# EAGLE design board (EAGLE 7.3.0)
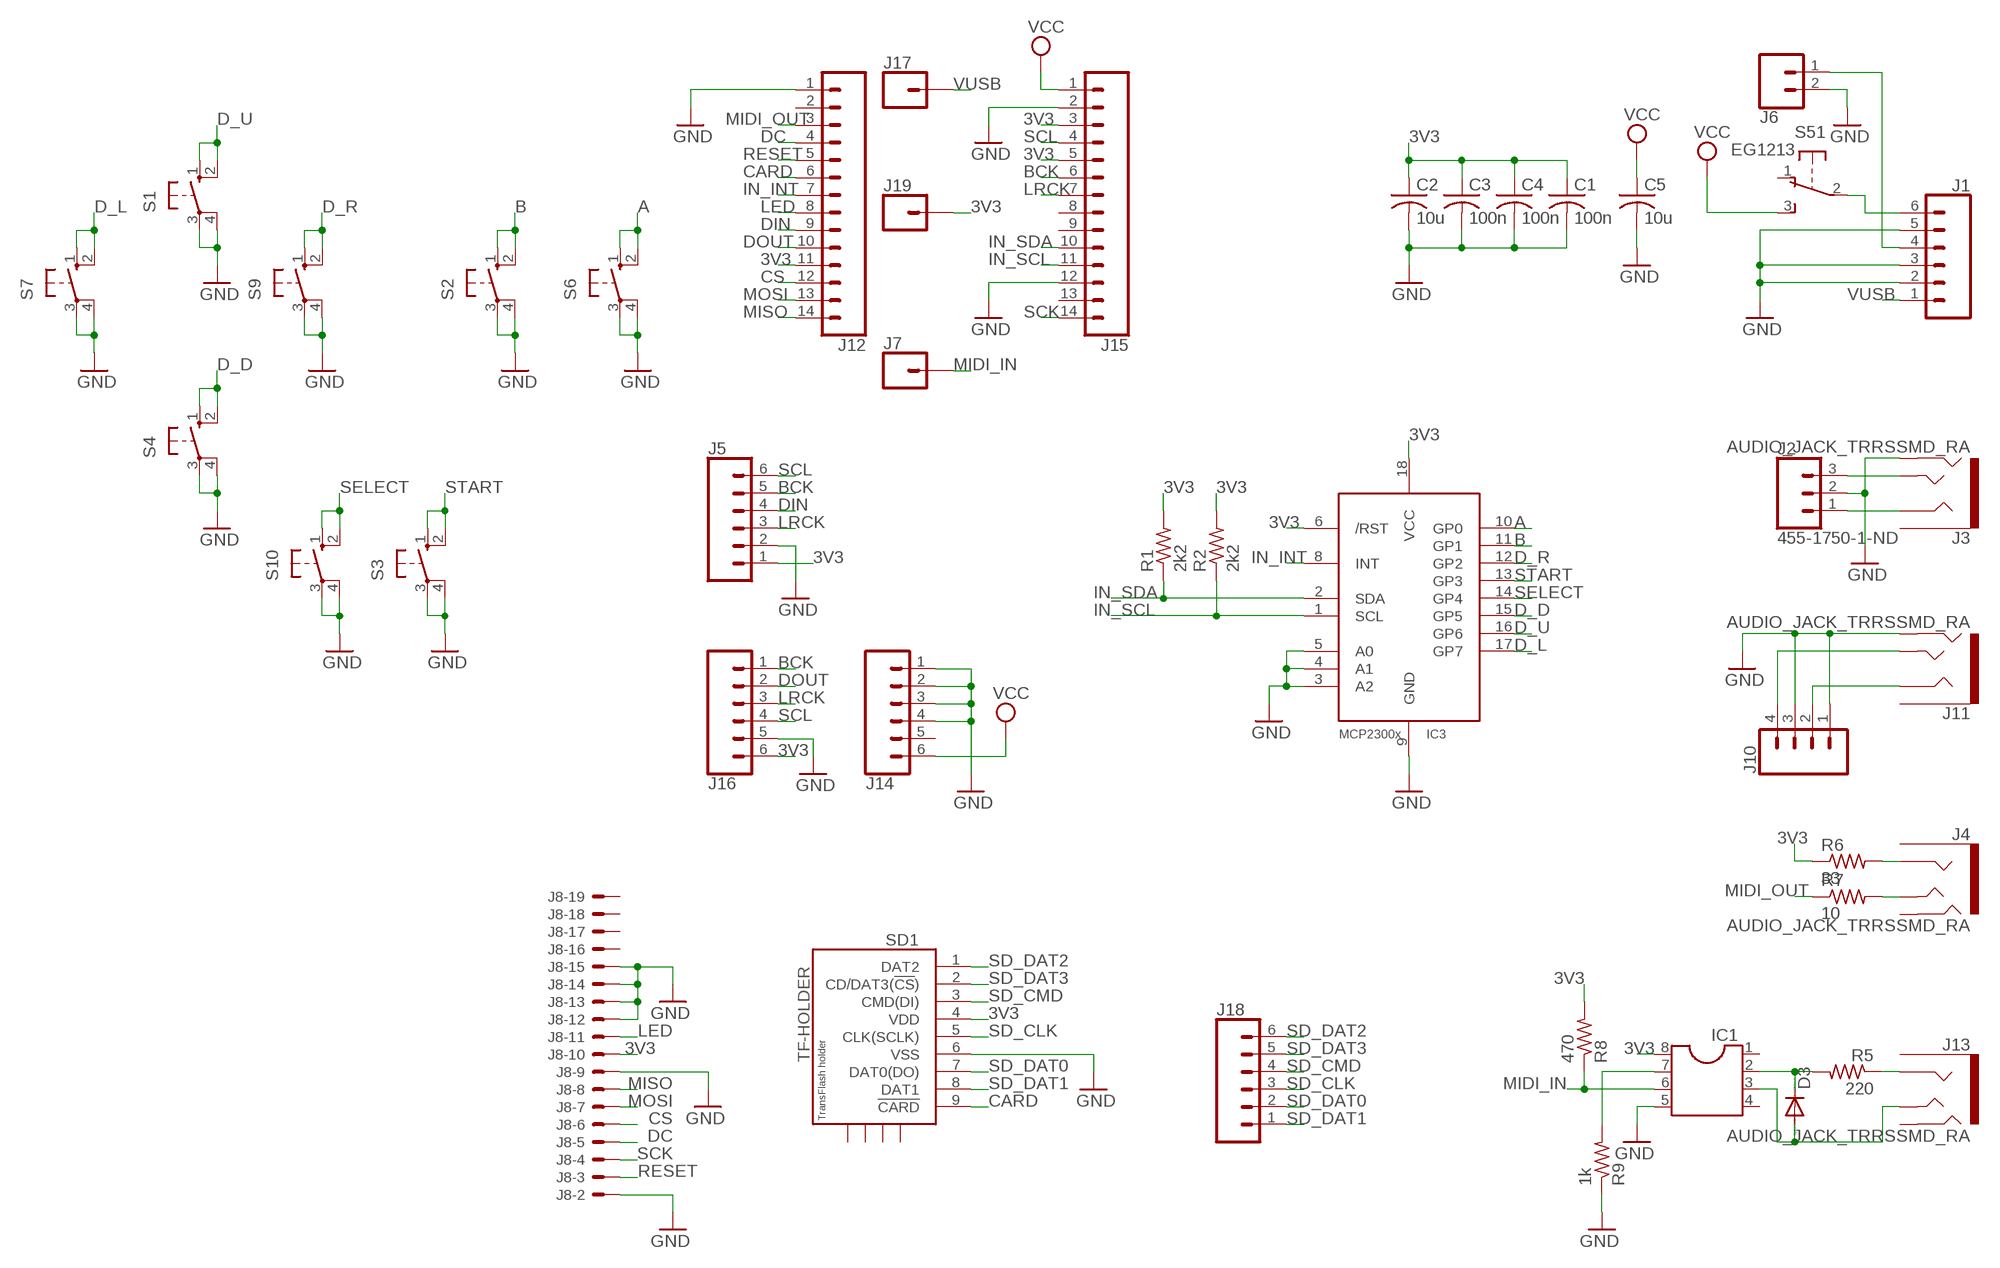
[diagram p0: schematic, sheet 1]

## Parts
C1  100n  C-USC0805  [C0805]
C2  10u  C-USC0805  [C0805]
C3  100n  C-USC0805  [C0805]
C4  100n  C-USC0805  [C0805]
C5  10u  C-USC0805  [C0805]
D3  DIODE-MINIMELF  [MINIMELF]
IC1  DIL8  [DIL08]
IC3  MCP23008/SO  [SO18W]
J1  CONN_06SILK_FEMALE_PTH  [1X06]
J2  455-1750-1-ND  CONN_03  [1X03]
J3  AUDIO_JACK_TRRSSMD_RA  [AUDIO_JACK_3.5MM_TRRS_SMD_RA]
J4  AUDIO_JACK_TRRSSMD_RA  [AUDIO_JACK_3.5MM_TRRS_SMD_RA]
J5  CONN_06SILK_FEMALE_PTH  [1X06]
J6  CONN_02  [1X02]
J7  CONN_01  [1X01]
J8  XF2E-2015-1  [XF2E-2015-1]
J10  CONN_04  [1X04]
J11  AUDIO_JACK_TRRSSMD_RA  [AUDIO_JACK_3.5MM_TRRS_SMD_RA]
J12  CONN_14  [1X14]
J13  AUDIO_JACK_TRRSSMD_RA  [AUDIO_JACK_3.5MM_TRRS_SMD_RA]
J14  CONN_06SILK_FEMALE_PTH  [1X06]
J15  CONN_14  [1X14]
J16  CONN_06SILK_FEMALE_PTH  [1X06]
J17  CONN_01  [1X01]
J18  CONN_06SILK_FEMALE_PTH  [1X06]
J19  CONN_01  [1X01]
R1  2k2  R-US_R0805  [R0805]
R2  2k2  R-US_R0805  [R0805]
R5  220  R-US_R0805  [R0805]
R6  33  R-US_R0805  [R0805]
R7  10  R-US_R0805  [R0805]
R8  470  R-US_R0805  [R0805]
R9  1k  R-US_R0805  [R0805]
S1  10-XX  [B3F-10XX]
S2  10-XX  [B3F-10XX]
S3  10-XX  [B3F-10XX]
S4  10-XX  [B3F-10XX]
S5  EG1213  [EG1213]
S6  10-XX  [B3F-10XX]
S7  10-XX  [B3F-10XX]
S9  10-XX  [B3F-10XX]
S10  10-XX  [B3F-10XX]
SD1  TF-HOLDER  [TF-PULL]

## Nets
3V3: C1.1 C2.1 C3.1 C4.1 IC1.8 IC3.6(/RST) IC3.18(VCC) J5.1 J8.10 J12.11 J15.3 J15.5 J16.6 J19.1 R1.2 R2.2 R6.1 R8.2 SD1.4(VDD)
A: IC3.10(GP0) S6.1(S) S6.2(S1)
B: IC3.11(GP1) S2.1(S) S2.2(S1)
BCK: J5.5 J15.6 J16.1
CARD: J12.6 SD1.9(!CARD)
CS: J8.6 J12.12
D_D: IC3.15(GP5) S4.1(S) S4.2(S1)
D_L: IC3.17(GP7) S7.1(S) S7.2(S1)
D_R: IC3.12(GP2) S9.1(S) S9.2(S1)
D_U: IC3.16(GP6) S1.1(S) S1.2(S1)
DC: J8.5 J12.4
DIN: J5.4 J12.9
DOUT: J12.10 J16.2
GND: C1.2 C2.2 C3.2 C4.2 C5.2 IC1.5 IC3.3(A2) IC3.4(A1) IC3.5(A0) IC3.9(GND) J1.2 J1.3 J1.5 J2.2 J3.RING2 J5.2 J6.2 J8.2 J8.9 J8.12 J8.13 J8.14 J8.15 J10.1 J10.3 J11.RING2 J12.1 J14.1 J14.2 J14.3 J14.4 J15.2 J15.12 J16.5 R9.1 S1.3(P) S1.4(P1) S2.3(P) S2.4(P1) S3.3(P) S3.4(P1) S4.3(P) S4.4(P1) S6.3(P) S6.4(P1) S7.3(P) S7.4(P1) S9.3(P) S9.4(P1) S10.3(P) S10.4(P1) SD1.6(VSS)
IN_INT: IC3.8(INT) J12.7
IN_SCL: IC3.1(SCL) J15.11 R2.1
IN_SDA: IC3.2(SDA) J15.10 R1.1
LED: J8.11 J12.8
LRCK: J5.3 J15.7 J16.3
MIDI_IN: IC1.6 J7.1 R8.1
MIDI_OUT: J12.3 R7.1
MISO: J8.8 J12.14
MOSI: J8.7 J12.13
N$2: J2.3 J3.TIP
N$3: J2.1 J3.RING1
N$4: J10.4 J11.TIP
N$5: J10.2 J11.RING1
N$6: J1.4 J6.1
N$14: J4.RING1 R6.2
N$16: J4.TIP R7.2
N$17: J13.RING1 R5.1
N$18: D3.C IC1.2 R5.2
N$19: D3.A IC1.3 J13.TIP
N$22: IC1.7 R9.2
N$24: J1.6 S5.2(1:P)
RESET: J8.3 J12.5
SCK: J8.4 J15.14
SCL: J5.6 J15.4 J16.4
SD_CLK: J18.3 SD1.5(CLK(SCLK))
SD_CMD: J18.4 SD1.3(CMD(DI))
SD_DAT0: J18.2 SD1.7(DAT0(DO))
SD_DAT1: J18.1 SD1.8(DAT1)
SD_DAT2: J18.6 SD1.1(DAT2)
SD_DAT3: J18.5 SD1.2(CD/DAT3(!CS!))
SELECT: IC3.14(GP4) S10.1(S) S10.2(S1)
START: IC3.13(GP3) S3.1(S) S3.2(S1)
VCC: C5.1 J14.6 J15.1 S5.3(1:S)
VUSB: J1.1 J17.1
Unconnected: IC1.1 IC1.4 J3.EARTH J4.EARTH J4.RING2 J8.16 J8.17 J8.18 J8.19 J11.EARTH J12.2 J13.EARTH J13.RING2 J14.5 J15.8 J15.9 J15.13 S5.1(1:O) S5.MT1(MT) S5.MT2(MT) SD1.S1 SD1.S2 SD1.S3 SD1.S4

## Library data of the parts
C1-C5 = rcl:C-US: CAPACITOR, American symbol
D3 = diode:DIODE-: DIODE
IC1 = ic-package:DIL8: Dual In Line / Socket
IC3 = adafruit:MCP23008: MCP23008 Inexpensive i2c i/o expander - 8 general purpose i/o pins with optional pullups
J1 J5 J14 J16 J18 = lbr_SparkFun-Eagle-Libraries_SparkFun-Connectors:CONN_06: Multi connection point. Often used as Generic Header-pin footprint for 0.1 inch spaced/style header connections On any of the 0.1 inch spaced packages, you can populate with these: Break Away Headers - Straight <https://www.sparkfun.com/products/116> (PRT-00116) Break Away Male Headers - Right Angle <https://www.sparkfun.com/products/553> (PRT-00553) Female Headers <https://www.sparkfun.com/products/115> (PRT-00115) Break Away Headers - Machine Pin <https://www.sparkfun.com/products/117> (PRT-00117) Break Away Female Headers - Swiss Machine Pin <https://www.sparkfun.com/products/743> (PRT-00743) Arduino Stackable Header - 6 Pin <https://www.sparkfun.com/products/9280> (PRT-09280) For SCREWTERMINALS and SPRING TERMINALS visit here: Screw Terimnals on SparkFun.com <https://www.sparkfun.com/search/results?term=Screw+Terminals> (5mm/3.5mm/2.54mm spacing) This device is also useful as a general connection point to wire up your design to another part of your project. Our various solder wires solder well into these plated through hole pads. Hook-Up Wire - Assortment (Stranded, 22 AWG) <https://www.sparkfun.com/products/11375> (PRT-11375) Hook-Up Wire - Assortment (Solid Core, 22 AWG) <https://www.sparkfun.com/products/11367> (PRT-11367) View the entire wire category on our website here <https://www.sparkfun.com/categories/141>; PROD_ID: CONN-08437
J2 = lbr_SparkFun-Eagle-Libraries_SparkFun-Connectors:CONN_03: Multi connection point. Often used as Generic Header-pin footprint for 0.1 inch spaced/style header connections On any of the 0.1 inch spaced packages, you can populate with these: Break Away Headers - Straight <https://www.sparkfun.com/products/116> (PRT-00116) Break Away Male Headers - Right Angle <https://www.sparkfun.com/products/553> (PRT-00553) Female Headers <https://www.sparkfun.com/products/115> (PRT-00115) Break Away Headers - Machine Pin <https://www.sparkfun.com/products/117> (PRT-00117) Break Away Female Headers - Swiss Machine Pin <https://www.sparkfun.com/products/743> (PRT-00743) Stackable Header - 3 Pin (Female, 0.1") <https://www.sparkfun.com/products/13875> (PRT-13875) For SCREWTERMINALS and SPRING TERMINALS visit here: Screw Terimnals on SparkFun.com <https://www.sparkfun.com/search/results?term=Screw+Terminals> (5mm/3.5mm/2.54mm spacing) This device is also useful as a general connection point to wire up your design to another part of your project. Our various solder wires solder well into these plated through hole pads. Hook-Up Wire - Assortment (Stranded, 22 AWG) <https://www.sparkfun.com/products/11375> (PRT-11375) Hook-Up Wire - Assortment (Solid Core, 22 AWG) <https://www.sparkfun.com/products/11367> (PRT-11367) View the entire wire category on our website here <https://www.sparkfun.com/categories/141> Special notes: Molex polarized connector foot print use with SKU : PRT-08232 with associated crimp pins and housings.; PROD_ID: XXX-00000
J3 J4 J11 J13 = lbr_SparkFun-Eagle-Libraries_SparkFun-Connectors:AUDIO_JACK_TRRS: Audio Jack - 3.5mm TRRS (SMD) This is a 3.5mm TRRS SMD audio jack. TRRS connectors are the audio-style connectors that you see on some phones, MP3 players and development boards. TRRS stands for “tip, ring, ring, sleeve,” which reflects that this has three conductors and a ground. SparkFun Products: Audio Jack <https://www.sparkfun.com/products/12639> mbed Starter Kit <https://www.sparkfun.com/products/12968> SparkFun TRRS 3.5mm Jack Breakout <https://www.sparkfun.com/products/11570>; PROD_ID: CONN-10676; SF_ID: PRT-12639
J6 = lbr_SparkFun-Eagle-Libraries_SparkFun-Connectors:CONN_02: Multi connection point. Often used as Generic Header-pin footprint for 0.1 inch spaced/style header connections On any of the 0.1 inch spaced packages, you can populate with these: Break Away Headers - Straight <https://www.sparkfun.com/products/116> (PRT-00116) Break Away Male Headers - Right Angle <https://www.sparkfun.com/products/553> (PRT-00553) Female Headers <https://www.sparkfun.com/products/115> (PRT-00115) Break Away Headers - Machine Pin <https://www.sparkfun.com/products/117> (PRT-00117) Break Away Female Headers - Swiss Machine Pin <https://www.sparkfun.com/products/743> (PRT-00743) For SCREWTERMINALS and SPRING TERMINALS visit here: Screw Terimnals on SparkFun.com <https://www.sparkfun.com/search/results?term=Screw+Terminals> (5mm/3.5mm/2.54mm spacing) This device is also useful as a general connection point to wire up your design to another part of your project. Our various solder wires solder well into these plated through hole pads. Hook-Up Wire - Assortment (Stranded, 22 AWG) <https://www.sparkfun.com/products/11375> (PRT-11375) Hook-Up Wire - Assortment (Solid Core, 22 AWG) <https://www.sparkfun.com/products/11367> (PRT-11367) View the entire wire category on our website here <https://www.sparkfun.com/categories/141> Special notes: Molex polarized connector foot print use with: PRT-08233 with associated crimp pins and housings. 2.54_SCREWTERM for use with PRT-10571. 3.5mm Screw Terminal footprints for PRT-08084 5mm Screw Terminal footprints for use with PRT-08432
J7 J17 J19 = lbr_SparkFun-Eagle-Libraries_SparkFun-Connectors:CONN_01: Single connection point. Often used as Generic Header-pin footprint for 0.1 inch spaced/style header connections On any of the 0.1 inch spaced packages, you can populate with these: Break Away Headers - Straight <https://www.sparkfun.com/products/116> (PRT-00116) Break Away Male Headers - Right Angle <https://www.sparkfun.com/products/553> (PRT-00553) Female Headers <https://www.sparkfun.com/products/115> (PRT-00115) Break Away Headers - Machine Pin <https://www.sparkfun.com/products/117> (PRT-00117) Break Away Female Headers - Swiss Machine Pin <https://www.sparkfun.com/products/743> (PRT-00743) This device is also useful as a general connection point to wire up your design to another part of your project. Our various solder wires solder well into these plated through hole pads. Hook-Up Wire - Assortment (Stranded, 22 AWG) <https://www.sparkfun.com/products/11375> (PRT-11375) Hook-Up Wire - Assortment (Solid Core, 22 AWG) <https://www.sparkfun.com/products/11367> (PRT-11367) View the entire wire category on our website here <https://www.sparkfun.com/categories/141> Special notes: SMTSO-256-ET is a "flush mount" nut for a 4-40 screw. We mostly use this on specialty testbeds; it is a nice way to connect hardware to your PCB at an adjustable hieght. Also note, the SNAP packages are for using a snappable style connector. We sell a baggie of snaps and they are also used on two LilyPad designs: Snap Assortment - 30 pack (male and female) <https://www.sparkfun.com/products/11347> (DEV-11347) LilyPad Arduino SimpleSnap <https://www.sparkfun.com/products/10941> (DEV-10941) LilyPad SimpleSnap Protoboard <https://www.sparkfun.com/products/10940> (DEV-10940)
J8 = con-omron-kopia:XF2*-20?: OMRON FPC Connector Source : http://www.omron.com/ecb/products/pdf/fpc.pdf; MPN: XF2E-2015-1; OC_FARNELL: unknown; OC_NEWARK: 37M9453
J10 = lbr_SparkFun-Eagle-Libraries_SparkFun-Connectors:CONN_04: Multi connection point. Often used as Generic Header-pin footprint for 0.1 inch spaced/style header connections On any of the 0.1 inch spaced packages, you can populate with these: Break Away Headers - Straight <https://www.sparkfun.com/products/116> (PRT-00116) Break Away Male Headers - Right Angle <https://www.sparkfun.com/products/553> (PRT-00553) Female Headers <https://www.sparkfun.com/products/115> (PRT-00115) Break Away Headers - Machine Pin <https://www.sparkfun.com/products/117> (PRT-00117) Break Away Female Headers - Swiss Machine Pin <https://www.sparkfun.com/products/743> (PRT-00743) For SCREWTERMINALS and SPRING TERMINALS visit here: Screw Terimnals on SparkFun.com <https://www.sparkfun.com/search/results?term=Screw+Terminals> (5mm/3.5mm/2.54mm spacing) This device is also useful as a general connection point to wire up your design to another part of your project. Our various solder wires solder well into these plated through hole pads. Hook-Up Wire - Assortment (Stranded, 22 AWG) <https://www.sparkfun.com/products/11375> (PRT-11375) Hook-Up Wire - Assortment (Solid Core, 22 AWG) <https://www.sparkfun.com/products/11367> (PRT-11367) View the entire wire category on our website here <https://www.sparkfun.com/categories/141> Special notes: Molex polarized connector foot print use with SKU : PRT-08231 with associated crimp pins and housings. 1MM SMD Version SKU: PRT-10208; PROD_ID: CONN-09696
J12 J15 = lbr_SparkFun-Eagle-Libraries_SparkFun-Connectors:CONN_14: Multi connection point. Often used as Generic Header-pin footprint for 0.1 inch spaced/style header connections On any of the 0.1 inch spaced packages, you can populate with these: Break Away Headers - Straight <https://www.sparkfun.com/products/116> (PRT-00116) Break Away Male Headers - Right Angle <https://www.sparkfun.com/products/553> (PRT-00553) Female Headers <https://www.sparkfun.com/products/115> (PRT-00115) Break Away Headers - Machine Pin <https://www.sparkfun.com/products/117> (PRT-00117) Break Away Female Headers - Swiss Machine Pin <https://www.sparkfun.com/products/743> (PRT-00743) For SCREWTERMINALS and SPRING TERMINALS visit here: Screw Terimnals on SparkFun.com <https://www.sparkfun.com/search/results?term=Screw+Terminals> (5mm/3.5mm/2.54mm spacing) This device is also useful as a general connection point to wire up your design to another part of your project. Our various solder wires solder well into these plated through hole pads. Hook-Up Wire - Assortment (Stranded, 22 AWG) <https://www.sparkfun.com/products/11375> (PRT-11375) Hook-Up Wire - Assortment (Solid Core, 22 AWG) <https://www.sparkfun.com/products/11367> (PRT-11367) View the entire wire category on our website here <https://www.sparkfun.com/categories/141> Special notes: Molex polarized connector foot print use with SKU : PRT-08231 with associated crimp pins and housings. 1MM SMD Version SKU: PRT-10208 NOTES ON THE VARIANTS LOCK and LOCK_LONGPADS... This footprint was designed to help hold the alignment of a through-hole component (i.e. 6-pin header) while soldering it into place. You may notice that each hole has been shifted either up or down by 0.005 of an inch from it's more standard position (which is a perfectly straight line). This slight alteration caused the pins (the squares in the middle) to touch the edges of the holes. Because they are alternating, it causes a "brace" to hold the component in place. 0.005 has proven to be the perfect amount of "off-center" position when using our standard breakaway headers. Although looks a little odd when you look at the bare footprint, once you have a header in there, the alteration is very hard to notice. Also,if you push a header all the way into place, it is covered up entirely on the bottom side.
R1 R2 R5-R9 = rcl:R-US_: RESISTOR, American symbol
S1-S4 S6 S7 S9 S10 = switch-omron:10-XX: OMRON SWITCH; MPN: B3F-1000; OC_FARNELL: 176432; OC_NEWARK: 36M3542
S5 = adafruit:EG1213: E-Switch right-angle slide SPDT Part #EG1213 http://www.ladyada.net/library/eagle
SD1 = sd-mmc:TF-HOLDER: TF / Micro SD socket is PUSH-PUSH type, the card can be pushed into and auto locked and pushed out by simply press the card. Surface Mounting type.

## Board
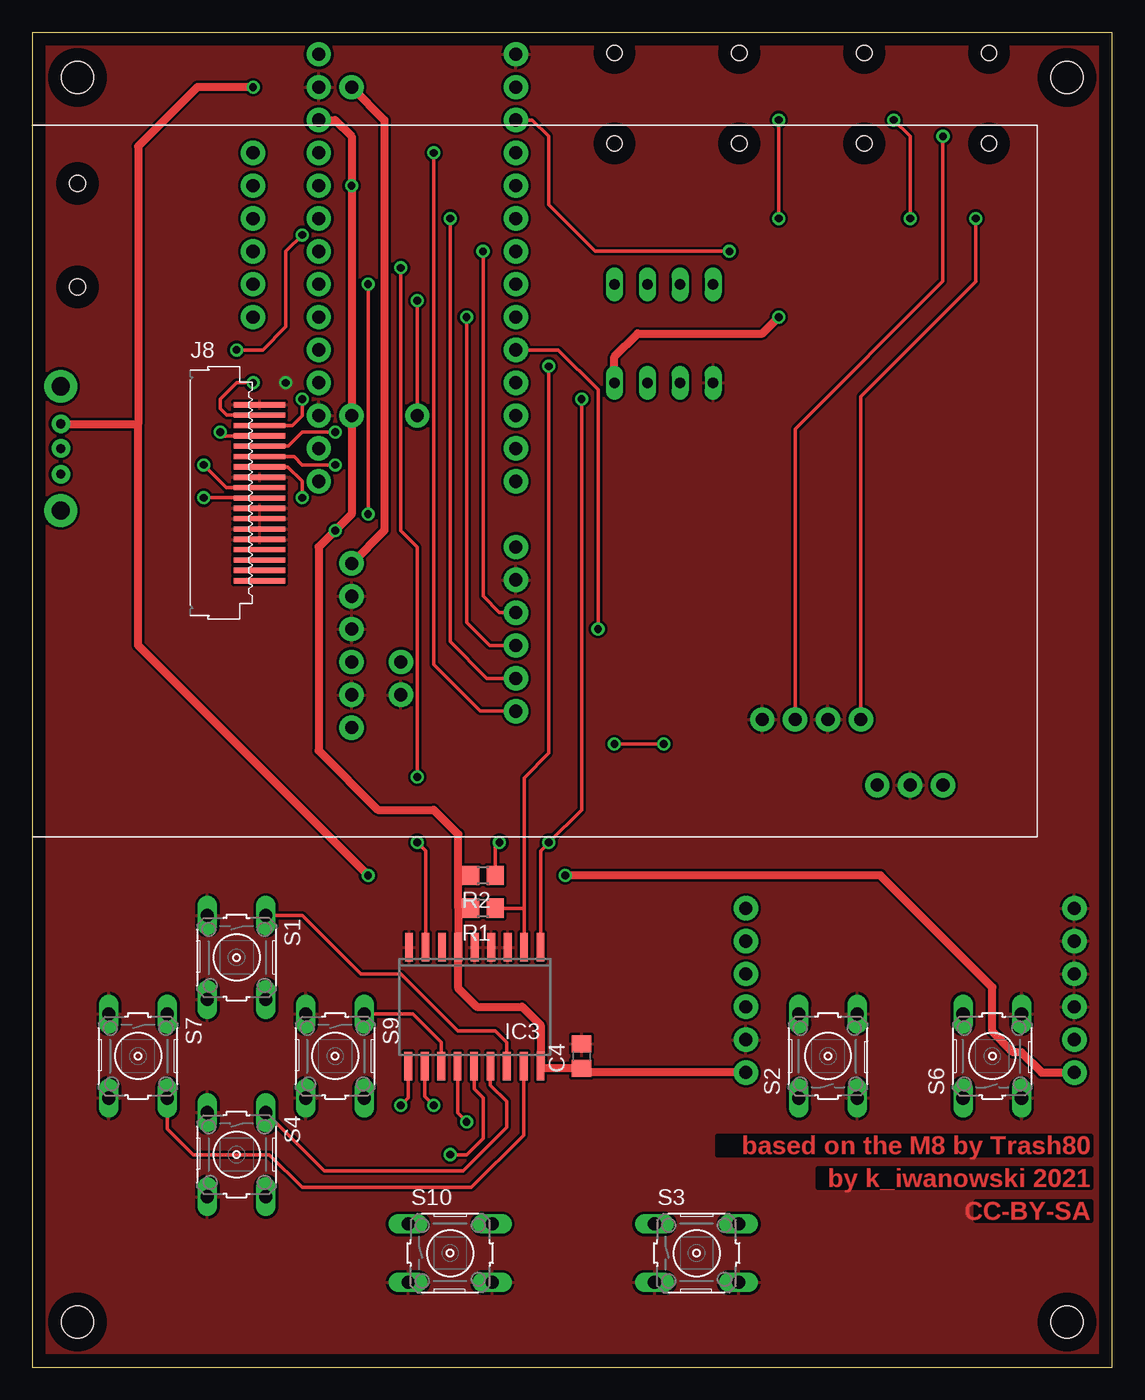
[diagram p1: board, top side]
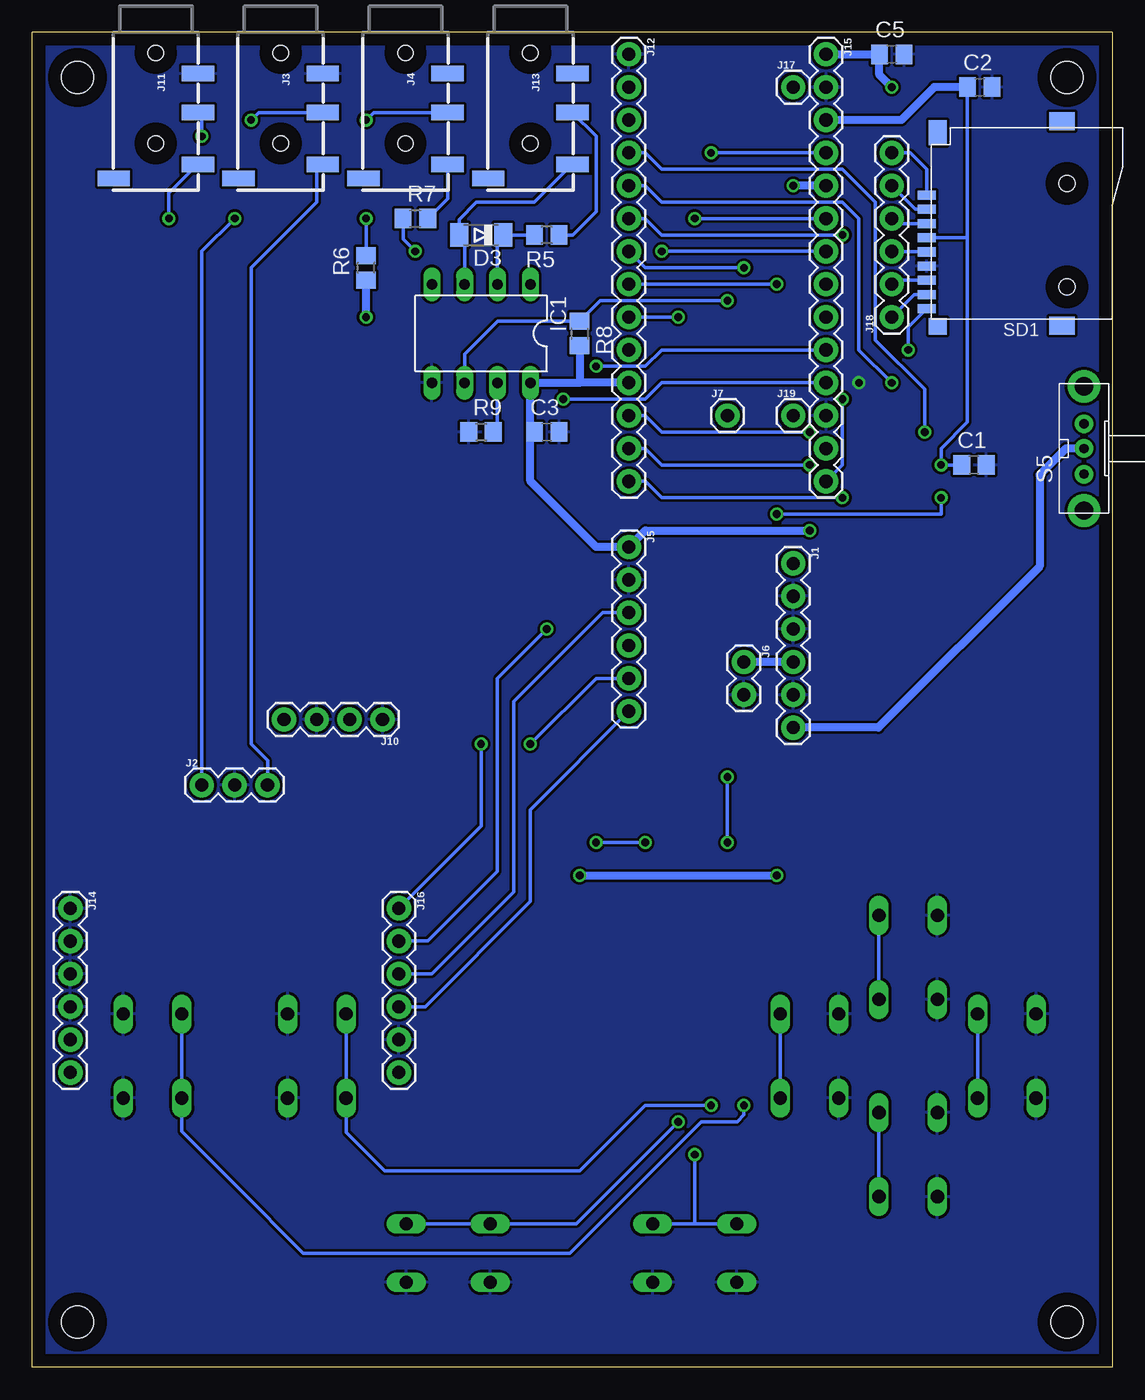
[diagram p2: board, bottom side, seen from below]

Size 83.5 x 103.23 mm. Coordinates in mm from the lower left corner, seen from the top.
Outline: 0,103.23 0,0 83.5,0 83.5,103.23 0,103.23
Copper layers (1*16): Top 0.035mm / dielectric 1.5mm / Bottom 0.035mm
Design rules "default *": minimum track width 8mil, minimum drill 24mil, track to track 8mil, track to pad 8mil, pad to pad 8mil, via to via 8mil, smd to smd 8mil, copper to edge 40mil, drill to drill 8mil, minimum pad ring 10mil, minimum via ring 8mil, stop-mask expansion 4mil, vias tented up to drill 0mil, thermal gap 8mil
Holes 2.5 mm at 3.5,99.73 80,99.73 3.5,3.5 80,3.5

### Footprints (pad centres in the part's own frame; a part is rotated, then mirrored left to right if it is on the bottom)
C0805 = smd 1.3 x 1.5: 1 -0.95,0; 2 0.95,0
MINIMELF = smd 1.4 x 1.8: A 1.7,0; C -1.7,0
DIL08 = drill 0.813 long: 1 -3.81,-3.81; 2 -1.27,-3.81; 3 1.27,-3.81; 4 3.81,-3.81; 5 3.81,3.81; 6 1.27,3.81; 7 -1.27,3.81; 8 -3.81,3.81
SO18W = smd 0.6 x 2.2: 1 -4.445,-4.6; 2 -3.175,-4.6; 3 -1.905,-4.6; 4 -0.635,-4.6; 5 0.635,-4.6; 6 1.905,-4.6; 7 3.175,-4.6; 8 4.445,-4.6; 9 5.715,-4.6; 10 5.775,4.6; 11 4.505,4.6; 12 3.235,4.6; 13 1.965,4.6; 14 0.695,4.6; 15 -0.575,4.6; 16 -1.845,4.6; 17 -3.145,4.6; 18 -4.445,4.6
1X06 = drill 1.016 pad 1.88: 1 0,0; 2 2.54,0; 3 5.08,0; 4 7.62,0; 5 10.16,0; 6 12.7,0
1X03 = drill 1.016 pad 1.88: 1 0,0; 2 2.54,0; 3 5.08,0
AUDIO_JACK_3.5MM_TRRS_SMD_RA = smd 1.2 x 2.5: EARTH 11.3,-3.25; RING1 6.2,3.25; RING2 3.2,3.25; TIP 10.2,3.25 | hole 1.2: 1.6,0; 8.6,0
1X02 = drill 1.016 pad 1.88: 1 0,0; 2 2.54,0
1X01 = drill 1.016 pad 1.88: 1 0,0
XF2E-2015-1 = smd 4 x 0.4: 2 2.54,6.8; 3 2.54,6; 4 2.54,5.2; 5 2.54,4.4; 6 2.54,3.6; 7 2.54,2.8; 8 2.54,2; 9 2.54,1.2; 10 2.54,0.4; 11 2.54,-0.4; 12 2.54,-1.2; 13 2.54,-2; 14 2.54,-2.8; 15 2.54,-3.6; 16 2.54,-4.4; 17 2.54,-5.2; 18 2.54,-6; 19 2.54,-6.8
1X04 = drill 1.016 pad 1.88: 1 0,0; 2 2.54,0; 3 5.08,0; 4 7.62,0
1X14 = drill 1.016 pad 1.88: 1 0,0; 2 2.54,0; 3 5.08,0; 4 7.62,0; 5 10.16,0; 6 12.7,0; 7 15.24,0; 8 17.78,0; 9 20.32,0; 10 22.86,0; 11 25.4,0; 12 27.94,0; 13 30.48,0; 14 33.02,0
R0805 = smd 1.3 x 1.5: 1 -0.95,0; 2 0.95,0
B3F-10XX = drill 1.016 long: 1 -3.251,2.261; 2 3.251,2.261; 3 -3.251,-2.261; 4 3.251,-2.261
EG1213 = drill 0.7 pad 1.422: 1 -2,0; 2 0,0; 3 1.9,0 | drill 1.4 pad 2.54: MT1 -4.8,0; MT2 4.8,0
TF-PULL = smd 0.7 x 1.4: 1 -2.2,-7.62; 2 -1.1,-7.62; 3 0,-7.62; 4 1.1,-7.62; 5 2.2,-7.62; 6 3.3,-7.62; 7 4.4,-7.62; 8 5.5,-7.62; 9 6.6,-7.62 | smd 1.4 x 2: S1 -7.9,2.85; S2 7.9,2.85 | smd 1.28 x 1.4: S3 7.96,-6.75 | smd 1.95 x 1.4: S4 -7.025,-6.75 | hole 1.25: -3.1,3.25; 4.9,3.25

### Placement (x,y rotation side)
C1  10.71,69.78 0 bottom
C2  10.26,98.99 0 bottom
C3  43.73,72.32 0 bottom
C4  42.46,24.06 90 top
C5  17.06,101.53 0 bottom
D3  48.81,87.56 180 bottom
IC1  48.81,79.94 180 bottom
IC3  34.84,27.87 180 top
J1  24.68,62.16 270 bottom
J2  70.4,45.02 0 bottom
J3  64.3,103.23 270 bottom
J4  54.65,103.23 270 bottom
J5  37.38,63.43 270 bottom
J6  28.49,54.54 270 bottom
J7  29.76,73.59 0 bottom
J8  15.03,67.62 0 top
J10  56.43,50.09 180 bottom
J11  73.96,103.23 270 bottom
J12  37.38,101.53 270 bottom
J13  45,103.23 270 bottom
J14  80.56,35.49 270 bottom
J15  22.14,101.53 270 bottom
J16  55.16,35.49 270 bottom
J17  24.68,98.99 0 bottom
J18  17.06,81.21 90 bottom
J19  24.68,73.59 0 bottom
R1  34.84,35.49 180 top
R2  34.84,38.03 180 top
R5  43.73,87.56 180 bottom
R6  57.7,85.02 90 bottom
R7  53.89,88.83 0 bottom
R8  41.19,79.94 270 bottom
R9  48.81,72.32 0 bottom
S1  15.79,31.68 270 top
S2  61.51,24.06 90 top
S3  51.35,8.82 0 top
S4  15.79,16.44 270 top
S5  2.2,71.05 90 bottom
S6  74.21,24.06 90 top
S7  8.17,24.06 270 top
S9  23.41,24.06 270 top
S10  32.3,8.82 0 top
SD1  6.75,88.45 270 bottom

### Tracks (layer width: path | path; a pad name or v marks a point on that pad's centre or on a via)
3V3  (via drill 0.6)
  Top 0.254: J8.10 15.01,68.02 v13.25,69.78
  Top 0.61: J16.6 42.78,22.79 C4.1 39.29,23.11 IC3.18 39.29,26.45 37.87,27.87 34.36,27.87 32.94,29.29 IC3.6 32.94,35.49 | 32.94,35.49 32.94,38.03 | 32.94,38.03 32.94,41.2 31.03,43.11 26.72,43.11 22.14,47.69 22.14,63.43 v23.41,64.7 24.68,65.97 J19.1 v24.68,91.37 24.68,95.18 23.41,96.45 J15.3 | R1.2 32.94,35.49 | R2.2 32.94,38.03 | IC1.8 45,78.14 46.8,79.94 56.43,79.94 v57.7,81.21
  Bottom 0.254: C1.1 v13.25,69.78 13.25,71.05 11.21,73.09 11.21,87.35 | 11.21,87.35 C2.1 | SD1.4 11.21,87.35
  Bottom 0.61: 45,72.32 45,68.51 39.92,63.43 J5.1 36.11,64.7 v23.41,64.7 | 45,72.32 IC1.8 41.19,76.13 | R8.2 41.19,76.13 | J12.11 41.19,76.13 | C3.1 45,72.32 | v57.7,81.21 R6.1 | C2.1 13.78,98.99 16.32,96.45 J15.3 | J15.5 v24.68,91.37
A  (via drill 0.6)
  Top 0.254: v28.49,20.25 29.07,20.82 IC3.10
  Bottom 0.254: S6.2 S6.1 71.95,18.22 67.63,13.9 62.55,8.82 41.95,8.82 39.92,10.85 31.79,18.98 29.02,18.98 28.49,19.51 v28.49,20.25
B  (via drill 0.6)
  Top 0.254: v31.03,20.25 30.34,20.95 IC3.11
  Bottom 0.254: S2.2 S2.1 59.25,18.14 56.27,15.17 41.19,15.17 36.11,20.25 v31.03,20.25
BCK  (via drill 0.6)
  Top 0.254: v32.3,88.83 32.3,56.11 35.14,53.27 J5.5 | v45,48.19 v48.81,48.19
  Bottom 0.254: J16.1 48.81,41.84 v48.81,48.19 | J5.5 39.92,53.27 v45,48.19 | J15.6 v32.3,88.83
CARD  (via drill 0.6)
  Top 0.254: v20.87,87.56 19.6,86.29 19.6,80.47 17.8,78.67 v15.79,78.67
  Bottom 0.254: J12.6 36.11,88.83 34.84,87.56 v20.87,87.56 | SD1.9 15.79,80.43 v15.79,78.67
CS  (via drill 0.6)
  Top 0.254: J8.6 19.77,71.22 20.87,72.32 v23.41,72.32
  Bottom 0.254: J12.12 36.11,73.59 34.84,72.32 v23.41,72.32
D_D
  Top 0.254: S4.1 22.57,15.17 33.32,15.17 36.69,18.53 36.69,20.54 35.41,21.81 IC3.15
  Bottom 0.254: S4.1 S4.2
D_L
  Top 0.254: S7.2 10.43,18.44 12.43,16.44 18.33,16.44 20.87,13.9 33.94,13.9 37.98,17.94 IC3.17
  Bottom 0.254: S7.1 S7.2
D_R
  Top 0.254: S9.1 29.42,27.31 31.61,25.13 IC3.12
  Bottom 0.254: S9.2 S9.1
D_U
  Top 0.254: S1.1 20.87,34.93 25.39,30.41 28.47,30.41 32.88,26 35.8,26 36.69,25.12 IC3.16
  Bottom 0.254: S1.1 S1.2
DC  (via drill 0.6)
  Top 0.254: J8.5 14.82,72.02 v14.52,72.32
  Bottom 0.254: J12.4 36.11,93.91 34.84,92.64 20.87,92.64 18.33,90.1 18.33,79.44 14.52,75.63 v14.52,72.32
DIN  (via drill 0.6)
  Top 0.254: J5.4 35.37,55.81 33.57,57.61 v33.57,81.21
  Bottom 0.254: J12.9 v33.57,81.21
DOUT  (via drill 0.6)
  Top 0.254: J12.10 40.66,78.67 43.73,75.6 v43.73,57.08
  Bottom 0.254: J16.2 52.93,32.95 47.54,38.34 47.54,53.27 v43.73,57.08
GND  (via drill 0.6)
  other vias: 19.6,76.13
  pour Bottom: -0.72,104.07 84.37,104.07 84.37,-1.34 -0.72,-1.34
  pour Top: 84.37,104.07 84.37,-1.34 -0.72,-1.34 -0.72,104.07
IN_INT  (via drill 0.6)
  Top 0.254: v29.76,40.57 30.39,39.94 IC3.8 | v29.76,45.65 29.76,63.43 28.49,64.7 v28.49,85.02
  Bottom 0.254: v29.76,40.57 v29.76,45.65 | v28.49,85.02 36.11,85.02 J12.7
IN_SCL  (via drill 0.6)
  Top 0.254: v42.46,74.86 42.46,43.11 v39.92,40.57 39.29,39.94 IC3.1 | v36.11,40.57 35.79,40.25 R2.1
  Bottom 0.254: J15.11 34.84,76.13 36.11,74.86 v42.46,74.86 | v36.11,40.57 v39.92,40.57
IN_SDA  (via drill 0.6)
  Top 0.254: v39.92,77.4 39.92,47.49 38.02,45.59 38.02,35.49 | R1.1 38.02,35.49 | 38.02,35.49 IC3.2
  Bottom 0.254: J15.10 34.84,78.67 36.11,77.4 v39.92,77.4
LED  (via drill 0.6)
  Top 0.254: v25.95,83.75 v25.95,65.97 | v13.25,67.24 17.57,67.24 J8.11
  Bottom 0.254: J12.8 v25.95,83.75 | v25.95,65.97 13.25,65.97 v13.25,67.24
LRCK  (via drill 0.6)
  Top 0.254: v34.84,86.29 34.84,59.62 36.11,58.35 J5.3
  Bottom 0.254: J16.3 52.62,30.41 46.27,36.76 46.27,51.49 39.41,58.35 J5.3 | J15.7 v34.84,86.29
MIDI_IN  (via drill 0.6)
  Top 0.254: v29.76,82.48 J7.1
  Bottom 0.254: IC1.6 50.08,78.33 47.52,80.89 R8.1 39.6,82.48 v29.76,82.48
MIDI_OUT  (via drill 0.6)
  Top 0.254: v53.89,86.29 43.51,86.29 39.92,89.88 39.92,95.18 38.65,96.45 J12.3
  Bottom 0.254: v53.89,86.29 54.84,87.24 R7.1
MISO  (via drill 0.6)
  Top 0.254: J8.8 19.76,69.62 20.87,68.51 v20.87,67.24
  Bottom 0.254: J12.14 36.11,68.51 34.84,67.24 v20.87,67.24
MOSI  (via drill 0.6)
  Top 0.254: J8.7 20.23,70.42 20.87,69.78 v23.41,69.78
  Bottom 0.254: J12.13 36.11,71.05 34.84,69.78 v23.41,69.78
N$2
  Bottom 0.254: J3.TIP 61.51,92.57 61.51,90.1 66.59,85.02 66.59,48.19 65.32,46.92 J2.3
N$3  (via drill 0.6)
  Top 0.254: v66.59,96.45 67.86,95.18 v67.86,88.83
  Bottom 0.254: J3.RING1 66.01,97.03 v66.59,96.45 | J2.1 70.4,86.29 v67.86,88.83
N$4  (via drill 0.6)
  Top 0.254: J10.4 64.05,75.08 72.94,83.97 v72.94,88.83
  Bottom 0.254: J11.TIP 72.94,90.8 v72.94,88.83
N$5  (via drill 0.6)
  Top 0.254: J10.2 58.97,72.56 70.4,83.99 v70.4,95.18
  Bottom 0.254: J11.RING1 70.4,97.03 v70.4,95.18
N$6
  Bottom 0.61: J1.4 J6.1
N$14  (via drill 0.6)
  Top 0.254: v57.7,88.83 v57.7,96.45
  Bottom 0.254: R6.2 v57.7,88.83 | J4.RING1 57.12,97.03 v57.7,96.45
N$16
  Bottom 0.254: R7.2 51.4,90.37 J4.TIP
N$17
  Bottom 0.254: 42.46,87.88 R5.1 41.72,87.56 39.92,89.36 39.92,95.2 J13.RING1
N$18
  Bottom 0.254: IC1.2 47.54,87.13 D3.C R5.2
N$19
  Bottom 0.254: IC1.3 50.08,87.13 D3.A 50.51,88.76 49.17,90.1 44.68,90.1 J13.TIP
N$22
  Bottom 0.254: R9.2 47.54,72.64 IC1.7
N$24
  Bottom 0.61: S5.2 3.59,71.05 5.63,69.01 5.63,61.92 18.09,49.46 J1.6
RESET  (via drill 0.6)
  Top 0.254: J8.3 15.02,73.62 14.52,74.12 14.52,74.86 15.79,76.13 v17.06,76.13
  Bottom 0.254: J12.5 36.11,91.37 34.84,90.1 20.87,90.1 19.6,88.83 19.6,78.67 v17.06,76.13
SCK  (via drill 0.6)
  Top 0.254: J8.4 20.1,72.82 20.87,73.59 v20.87,74.86
  Bottom 0.254: J15.14 20.87,69.78 v20.87,74.86
SCL  (via drill 0.6)
  Top 0.254: v31.03,93.91 31.03,54.32 34.62,50.73 J5.6
  Bottom 0.254: J5.6 45,43.11 45,36 53.13,27.87 J16.4 | J15.4 v31.03,93.91
SD_CLK
  Bottom 0.254: SD1.5 17.02,86.25 J18.3
SD_CMD
  Bottom 0.254: SD1.3 16.68,88.45 J18.4
SD_DAT0
  Bottom 0.254: SD1.7 16.76,84.05 J18.2
SD_DAT1
  Bottom 0.254: SD1.8 15.32,82.95 15.79,82.48 J18.1
SD_DAT2
  Bottom 0.254: J18.6 15.65,93.91 14.37,92.63 SD1.1
SD_DAT3
  Bottom 0.254: SD1.2 15.24,89.55 15.79,90.1 J18.5
SELECT  (via drill 0.6)
  Top 0.254: v32.3,16.44 33.57,16.44 34.84,17.71 34.84,20.82 34.15,21.52 IC3.14
  Bottom 0.254: 32.3,11.08 v32.3,16.44 | S10.2 32.3,11.08 | 32.3,11.08 S10.1
START  (via drill 0.6)
  Top 0.254: v33.57,18.98 32.88,19.68 IC3.13
  Bottom 0.254: S3.2 S3.1 41.47,11.08 v33.57,18.98
VCC  (via drill 0.6)
  Top 0.61: J14.6 78.02,22.79 76.45,24.36 75.81,24.36 74.21,25.96 74.21,29.38 65.56,38.03 v41.19,38.03 | v25.95,38.03 8.17,55.81 8.17,72.95 | v17.06,98.99 12.75,98.99 8.17,94.41 8.17,72.95 | S5.3 8.17,72.95
  Bottom 0.61: v41.19,38.03 v25.95,38.03 | J15.1 C5.1 18.01,99.94 v17.06,98.99
VUSB
  Top 0.61: J17.1 27.22,96.45 27.22,64.7 J1.1

### Text on the board
Top: based on the M8 by Trash80 | by k_iwanowski 2021 | CC-BY-SA